# Altium schematic sheet Neural_Interface.SchDoc
size A4; DocumentNumber: 1; SheetNumber: 1; SheetTotal: 2
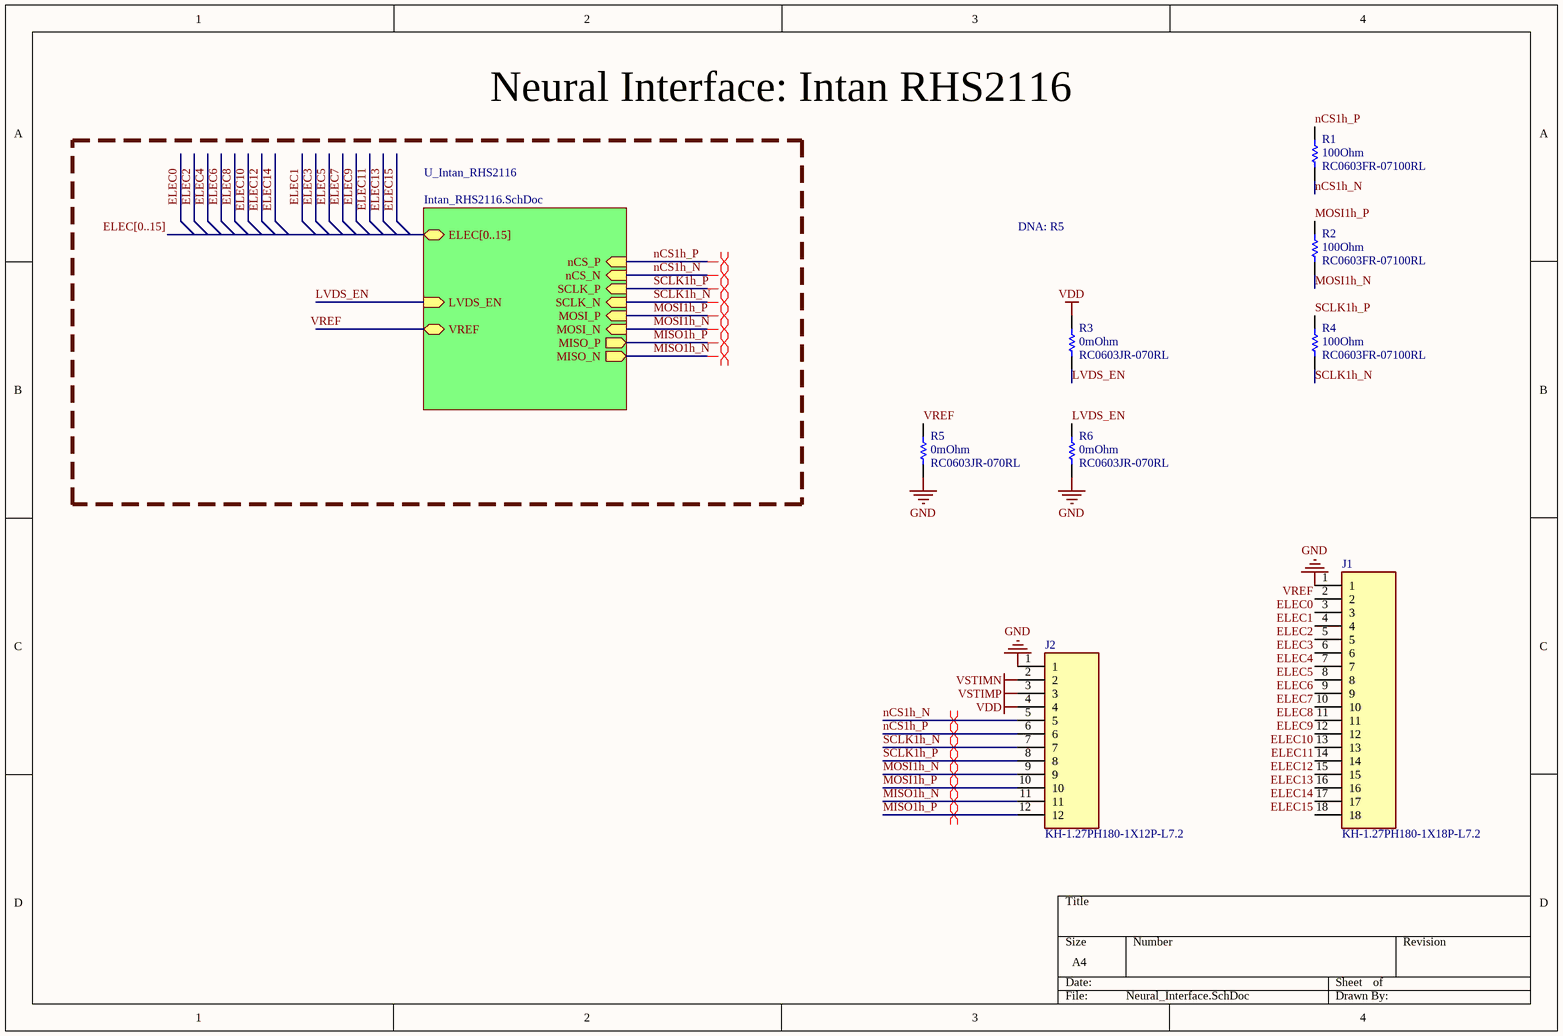
[diagram p0: Neural_Interface.SchDoc]

## Parts
J1  KH-1.27PH180-1X18P-L7.2  [KH-1.27PH180-1X18P-L7.2]
J2  KH-1.27PH180-1X12P-L7.2  [KH-1.27PH180-1X12P-L7.2]
R1  RC0603FR-07100RL  Resistance: 100Ohm  [RESC1608X55X25ML10T15]
R2  RC0603FR-07100RL  Resistance: 100Ohm  [RESC1608X55X25ML10T15]
R3  RC0603JR-070RL  Resistance: 0mOhm  [RESC1608X55X25ML10T15]
R4  RC0603FR-07100RL  Resistance: 100Ohm  [RESC1608X55X25ML10T15]
R5  RC0603JR-070RL  Resistance: 0mOhm  [RESC1608X55X25ML10T15]
R6  RC0603JR-070RL  Resistance: 0mOhm  [RESC1608X55X25ML10T15]

## Sub-sheets
U_Intan_RHS2116 = Intan_RHS2116.SchDoc: nCS_N (in), nCS_P (in), SCLK_N (in), SCLK_P (in), MOSI_N (in), MOSI_P (in), MISO_N (out), MISO_P (out), ELEC[0..15] (bidir), LVDS_EN (in), VREF (bidir)

## Nets
GND: J1.1 J2.1 R5.1 R6.1
VDD: J2.4 R3.2
VSTIMN: J2.2
VSTIMP: J2.3
ELEC0: J1.3
ELEC1: J1.4
ELEC2: J1.5
ELEC3: J1.6
ELEC4: J1.7
ELEC5: J1.8
ELEC6: J1.9
ELEC7: J1.10
ELEC8: J1.11
ELEC9: J1.12
ELEC10: J1.13
ELEC11: J1.14
ELEC12: J1.15
ELEC13: J1.16
ELEC14: J1.17
ELEC15: J1.18
LVDS_EN: R3.1 R6.2 ; sheet U_Intan_RHS2116/LVDS_EN
MISO1h_N: J2.11 ; sheet U_Intan_RHS2116/MISO_N
MISO1h_P: J2.12 ; sheet U_Intan_RHS2116/MISO_P
MOSI1h_N: J2.9 R2.1 ; sheet U_Intan_RHS2116/MOSI_N
MOSI1h_P: J2.10 R2.2 ; sheet U_Intan_RHS2116/MOSI_P
nCS1h_N: J2.5 R1.1 ; sheet U_Intan_RHS2116/nCS_N
nCS1h_P: J2.6 R1.2 ; sheet U_Intan_RHS2116/nCS_P
SCLK1h_N: J2.7 R4.1 ; sheet U_Intan_RHS2116/SCLK_N
SCLK1h_P: J2.8 R4.2 ; sheet U_Intan_RHS2116/SCLK_P
VREF: J1.2 R5.2 ; sheet U_Intan_RHS2116/VREF

## Buses and harness runs
bus ELEC[0..15] = sheet U_Intan_RHS2116/ELEC[0..15]

## Layout directives
differential pair: MISO1h_N, MISO1h_P, MOSI1h_N, MOSI1h_P, nCS1h_N, nCS1h_P, SCLK1h_N, SCLK1h_P

## Notes on the sheet
- Neural Interface: Intan RHS2116
- DNA: R5

## Library data of the parts
J1 = KH-1.27PH180-1X18P-L7.2: 1A Straight Square Pins 1mm 3.9mm -40℃~+105℃ 1 18 2.3mm 1.27mm 1x18P Straight, P=1.27mm Pin Headers ROHS; Manufacturer 1: Shenzhen Kinghelm Elec; Manufacturer Part Number 1: KH-1.27PH180-1X18P-L7.2
J2 = KH-1.27PH180-1X12P-L7.2: 1A Straight Square Pins 1mm 3.9mm -40℃~+105℃ 1 2.3mm 12 1.27mm 1x12P Straight, P=1.27mm Pin Headers ROHS; Manufacturer 1: Shenzhen Kinghelm Elec; Manufacturer Part Number 1: KH-1.27PH180-1X12P-L7.2
R1 R2 R4 = CMP-2100-03663-1: Chip Resistor, 100 Ohm, +/- 1%, 0.1 W, -55 to 155 degC, 0603 (1608 Metric), RoHS, Tape and Reel; Manufacturer: Yageo; Voltage Rating (DC): 50V; Power Rating: 100mW; Temperature Coefficient: 100ppm/degreesC; Number of Pins: 2; Tolerance: 1%; Height: 0.45mm; Manufacturer URL: http://www.yageo.com/; Military Standard: Not; Datasheet URL: http://www.yageo.com/NewPortal/yageodocoutput?fileName=/pdf/R-Chip/PYu-RC_Group_51_RoHS_L_5.pdf; Case Code (Imperial): 0603; Termination: SMD/SMT; Lead Free: LeadFree; Max Operating Temperature: 155degC; Case Code (Metric): 1608; RoHSCompliant: true; Voltage Rating: 50V; Width: 0.8mm; Composition: ThickFilm; Depth: 0.8mm; REACH SVHC: Unknown; Min Operating Temperature: -55degC; Packaging: TapeandReel; Package Description: 2-Pin Surface Mount Device, Body 1.6 x 0.8 mm; Length: 1.6mm; Package Reference: 0603; Datasheet Version: Rev. 5, 10/2016; Case/Package: 0603
R3 R5 R6 = CMP-2100-03667-1: Chip Resistor, 0 Ohm, +/- 5%, 0.1 W, -55 to 155 degC, 0603 (1608 Metric), RoHS, Tape and Reel; Manufacturer: Yageo; Temperature Coefficient: 200ppm/degreesC; Voltage Rating: 50V; Power Rating: 100mW; Width: 0.8mm; Max Operating Temperature: 155degC; Tolerance: 5%; Package Reference: 0603; Height: 0.45mm; Depth: 0.8mm; Package Description: 2-Pin Surface Mount Device, Body 1.6 x 0.8 mm; Termination: SMD/SMT; Package Quantity: 5000; Case/Package: 0603; Case Code (Imperial): 0603; Radiation Hardening: No; Number of Pins: 2; Length: 1.6mm; Lead Free: LeadFree; Voltage Rating (DC): 50V; Military Standard: Not; Datasheet URL: http://www.yageo.com/NewPortal/yageodocoutput?fileName=/pdf/R-Chip/PYu-RC_Group_51_RoHS_L_5.pdf; Manufacturer URL: http://www.yageo.com/; Packaging: TapeandReel; Case Code (Metric): 1608; Min Operating Temperature: -55degC; Composition: ThickFilm; RoHSCompliant: true; Contact Plating: Tin; Datasheet Version: Rev. 5, 10/2016; REACH SVHC: NoSVHC